# Altium project Main.PrjPCB
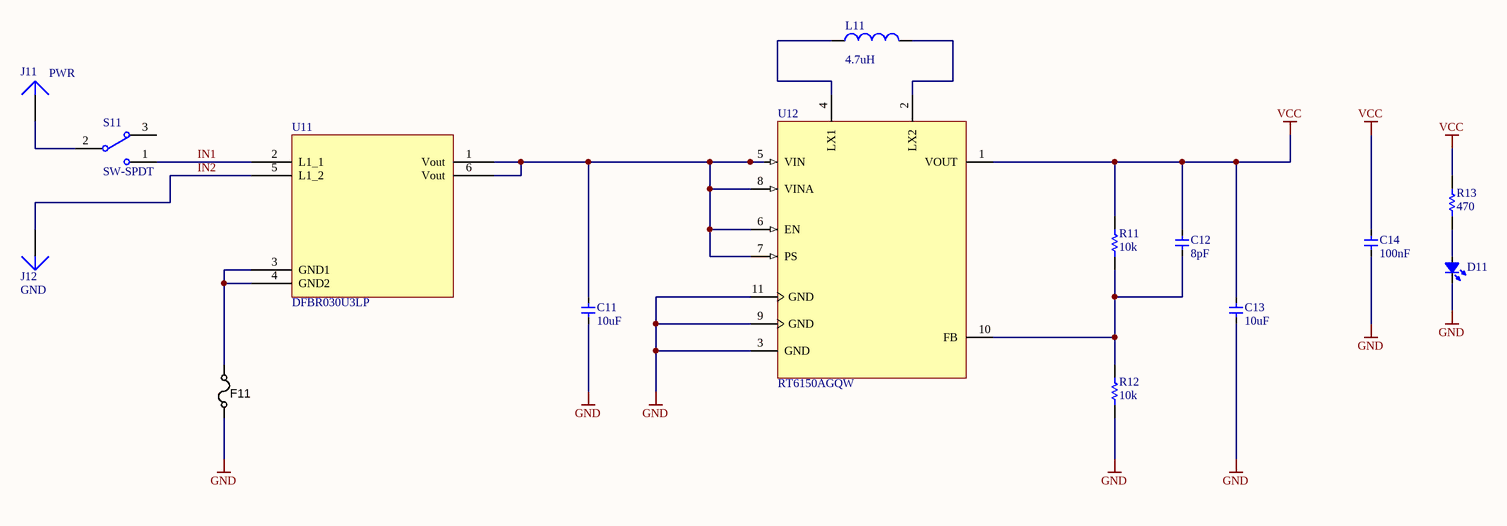
[diagram p0: 1 - Power.SchDoc]
2 sheets, 57 parts. Net scope: global (net labels, ports and power ports of the same name join across sheets).
Board file: PCB.PcbDoc
Sheets:
  1 - Power.SchDoc
  4 - Output.SchDoc

## Sheet 1 - Power.SchDoc
size A4

### Parts
C11  value 10uF  [CAPC2012X135N]  (hidden comment: Cap_0603)
C12  value 8pF  [CAP_0603]  (hidden comment: Cap_0603)
C13  value 10uF  [CAPC2012X135N]  (hidden comment: Cap_0603)
C14  value 100nF  [CAP_0603]  (hidden comment: Cap_0603)
D11  LED_0603  [LED_0603_RED]  (value not drawn)
F11  Slow-blow  [RESC3216X70N]  (value not drawn)
J11  PWR  [PIN1]
J12  GND  [PIN1]
L11  value 4.7uH  [RES_0805]  (hidden comment: Inductor)
R11  value 10k  [RES_0603]  (hidden comment: Res1)
R12  value 10k  [RES_0603]  (hidden comment: Res1)
R13  value 470  [RES_0603]  (hidden comment: Res1)
S11  SW-SPDT  [MSK-12C02]
U11  DFBR030U3LP  [U-DFN4040-8]
U12  RT6150AGQW  [DFN-MF10]

### Nets
GND: C11.1 C13.1 C14.1 D11.2(K) F11.1 R12.1 U12.3(GND) U12.9(GND) U12.11(GND)
VCC: C12.2 C13.2 C14.2 R11.2 R13.2 U12.1(VOUT)
IN1: S11.1 U11.2(L1_1)
IN2: J12.1 U11.5(L1_2)
NetC11_2: C11.2 U11.1(Vout) U11.6(Vout) U12.5(VIN) U12.6(EN) U12.7(PS) U12.8(VINA)
NetC12_1: C12.1 R11.1 R12.2 U12.10(FB)
NetD11_1: D11.1(A) R13.1
NetF11_2: F11.2 U11.3(GND1) U11.4(GND2)
NetJ11_1: J11.1 S11.2
NetL11_1: L11.1 U12.4(LX1)
NetL11_2: L11.2 U12.2(LX2)

Not connected (* = marked no-connect by the designer): S11 3

### Library data of the parts
C11-C14 = Cap_0603: Capacitor
D11 = LED_0603: LED
F11 = FUSE_160mA_1206: Fuse 750mA 6VDC 1206 SMD; Manufacturer 1: TE Connectivity; Manufacturer Part Number 1: NANOSMDC075F-2; Ratings: 750mA; 6VDC; slow-blow; SCDType: spec; Package / Case: 1206 (3216 metric); Value: 750mA
J11 J12 = Plug: LatestRevisionDate: 17-Jul-2002; LatestRevisionNote: Re-released for DXP Platform.; Publisher: Altium Limited
L11 = Inductor: Code_IEC: 2012; Published: 8-Jun-2000; LatestRevisionDate: 29-May-2009; LatestRevisionNote: IPC-7351 Footprint Added.; PackageReference: 0402-A; Publisher: Altium Limited; PackageDescription: Chip Inductor; Code_JEITA: 0805
R11-R13 = Res1: Resistor; Published: 8-Jun-2000; LatestRevisionDate: 17-Jul-2002; LatestRevisionNote: Re-released for DXP Platform.; PackageReference: AXIAL-0.3; Publisher: Altium Limited; PackageDescription: Axial Device, Thru-Hole; 2 Leads; 0.3 in Pin Spacing
S11 = SW-SPDT: SPDT Subminiature Toggle Switch, Right Angle Mounting, Vertical Actuation; Published: 24-Mar-1999; LatestRevisionDate: 17-Dec-2003; LatestRevisionNote: Schematic revised, PCB Footprint replaced.; DatasheetVersion: 05-Dec-2000; PackageReference: TL36WW15050; Publisher: Altium Limited; PackageDescription: Switch; 4 Leads; ComponentLink1Description: Manufacturer Link; ComponentLink1URL: http://www.apem.com
U11 = DFBR030U3LP: 3A Full Bridge Rectifier
U12 = RT6150AGQW: Buck-Boost Switching Regulator IC Positive Adjustable 1.8V 1 Output 800mA 10-WFDFN Exposed Pad; PackageReference: 10-WDFN (3x3); PackageDescription: 10-WFDFN Exposed Pad; Supplier 1: Digi-Key; Supplier Part Number 1: 1028-1259-1-ND; ComponentLink1Description: Datasheet; ComponentLink1URL: http://www.richtek.com/assets/product_file/RT6150A=RT6150B/DS6150AB-05.pdf; ComponentLink2Description: Packaging Specification

## Sheet 4 - Output.SchDoc
size A4
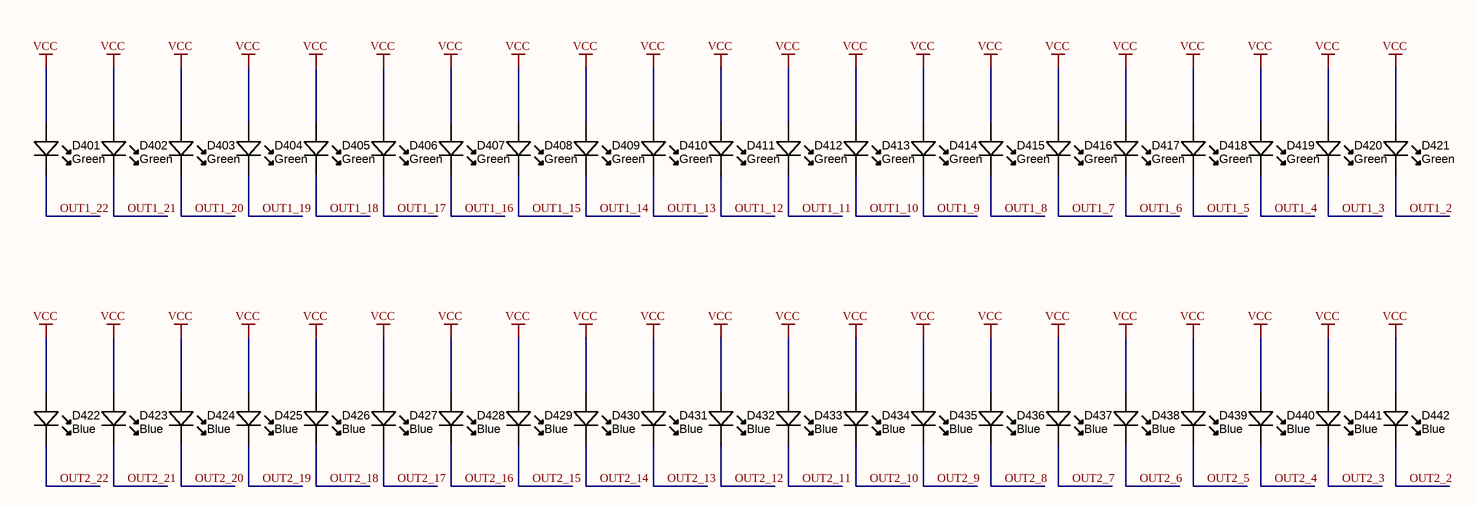
[diagram p1: 4 - Output.SchDoc]

### Parts
D401  Green  [LED-0805S-SIDELED-2.1X0.6X1.0]
D402  Green  [LED-0805S-SIDELED-2.1X0.6X1.0]
D403  Green  [LED-0805S-SIDELED-2.1X0.6X1.0]
D404  Green  [LED-0805S-SIDELED-2.1X0.6X1.0]
D405  Green  [LED-0805S-SIDELED-2.1X0.6X1.0]
D406  Green  [LED-0805S-SIDELED-2.1X0.6X1.0]
D407  Green  [LED-0805S-SIDELED-2.1X0.6X1.0]
D408  Green  [LED-0805S-SIDELED-2.1X0.6X1.0]
D409  Green  [LED-0805S-SIDELED-2.1X0.6X1.0]
D410  Green  [LED-0805S-SIDELED-2.1X0.6X1.0]
D411  Green  [LED-0805S-SIDELED-2.1X0.6X1.0]
D412  Green  [LED-0805S-SIDELED-2.1X0.6X1.0]
D413  Green  [LED-0805S-SIDELED-2.1X0.6X1.0]
D414  Green  [LED-0805S-SIDELED-2.1X0.6X1.0]
D415  Green  [LED-0805S-SIDELED-2.1X0.6X1.0]
D416  Green  [LED-0805S-SIDELED-2.1X0.6X1.0]
D417  Green  [LED-0805S-SIDELED-2.1X0.6X1.0]
D418  Green  [LED-0805S-SIDELED-2.1X0.6X1.0]
D419  Green  [LED-0805S-SIDELED-2.1X0.6X1.0]
D420  Green  [LED-0805S-SIDELED-2.1X0.6X1.0]
D421  Green  [LED-0805S-SIDELED-2.1X0.6X1.0]
D422  Blue  [LED-0805S-SIDELED-2.1X0.6X1.0]
D423  Blue  [LED-0805S-SIDELED-2.1X0.6X1.0]
D424  Blue  [LED-0805S-SIDELED-2.1X0.6X1.0]
D425  Blue  [LED-0805S-SIDELED-2.1X0.6X1.0]
D426  Blue  [LED-0805S-SIDELED-2.1X0.6X1.0]
D427  Blue  [LED-0805S-SIDELED-2.1X0.6X1.0]
D428  Blue  [LED-0805S-SIDELED-2.1X0.6X1.0]
D429  Blue  [LED-0805S-SIDELED-2.1X0.6X1.0]
D430  Blue  [LED-0805S-SIDELED-2.1X0.6X1.0]
D431  Blue  [LED-0805S-SIDELED-2.1X0.6X1.0]
D432  Blue  [LED-0805S-SIDELED-2.1X0.6X1.0]
D433  Blue  [LED-0805S-SIDELED-2.1X0.6X1.0]
D434  Blue  [LED-0805S-SIDELED-2.1X0.6X1.0]
D435  Blue  [LED-0805S-SIDELED-2.1X0.6X1.0]
D436  Blue  [LED-0805S-SIDELED-2.1X0.6X1.0]
D437  Blue  [LED-0805S-SIDELED-2.1X0.6X1.0]
D438  Blue  [LED-0805S-SIDELED-2.1X0.6X1.0]
D439  Blue  [LED-0805S-SIDELED-2.1X0.6X1.0]
D440  Blue  [LED-0805S-SIDELED-2.1X0.6X1.0]
D441  Blue  [LED-0805S-SIDELED-2.1X0.6X1.0]
D442  Blue  [LED-0805S-SIDELED-2.1X0.6X1.0]

### Nets
VCC: D401.A D402.A D403.A D404.A D405.A D406.A D407.A D408.A D409.A D410.A D411.A D412.A D413.A D414.A D415.A D416.A D417.A D418.A D419.A D420.A D421.A D422.A D423.A D424.A D425.A D426.A D427.A D428.A D429.A D430.A D431.A D432.A D433.A D434.A D435.A D436.A D437.A D438.A D439.A D440.A D441.A D442.A
OUT1_2: D421.K
OUT1_3: D420.K
OUT1_4: D419.K
OUT1_5: D418.K
OUT1_6: D417.K
OUT1_7: D416.K
OUT1_8: D415.K
OUT1_9: D414.K
OUT1_10: D413.K
OUT1_11: D412.K
OUT1_12: D411.K
OUT1_13: D410.K
OUT1_14: D409.K
OUT1_15: D408.K
OUT1_16: D407.K
OUT1_17: D406.K
OUT1_18: D405.K
OUT1_19: D404.K
OUT1_20: D403.K
OUT1_21: D402.K
OUT1_22: D401.K
OUT2_2: D442.K
OUT2_3: D441.K
OUT2_4: D440.K
OUT2_5: D439.K
OUT2_6: D438.K
OUT2_7: D437.K
OUT2_8: D436.K
OUT2_9: D435.K
OUT2_10: D434.K
OUT2_11: D433.K
OUT2_12: D432.K
OUT2_13: D431.K
OUT2_14: D430.K
OUT2_15: D429.K
OUT2_16: D428.K
OUT2_17: D427.K
OUT2_18: D426.K
OUT2_19: D425.K
OUT2_20: D424.K
OUT2_21: D423.K
OUT2_22: D422.K

### Library data of the parts
D401-D442 = LED_SMD_PureGreen_0805RA_250mcd: LED 0805 SIDELED SMD Green 250mcd 525nm; Manufacturer 1: Kingbright Corp; Manufacturer Part Number 1: APA2106ZGC; Material: InGaN; Ratings: 250 mcd; 525 nm; SCDType: source; Package / Case: 2.1x0.6x1.0mm SIDELED; Supplier 1: Digi-Key; Supplier Part Number 1: 754-1062-1-ND
  D401-D421: Value: Green; Color: Green
  D422-D442: Value: Blue; Color: Blue

## Nets that join several sheets
VCC: 1 - Power (6 pins), 4 - Output (42 pins)